# EAGLE design Button_Input_Card (EAGLE 7.6.0)

## Sheet 1 of 2
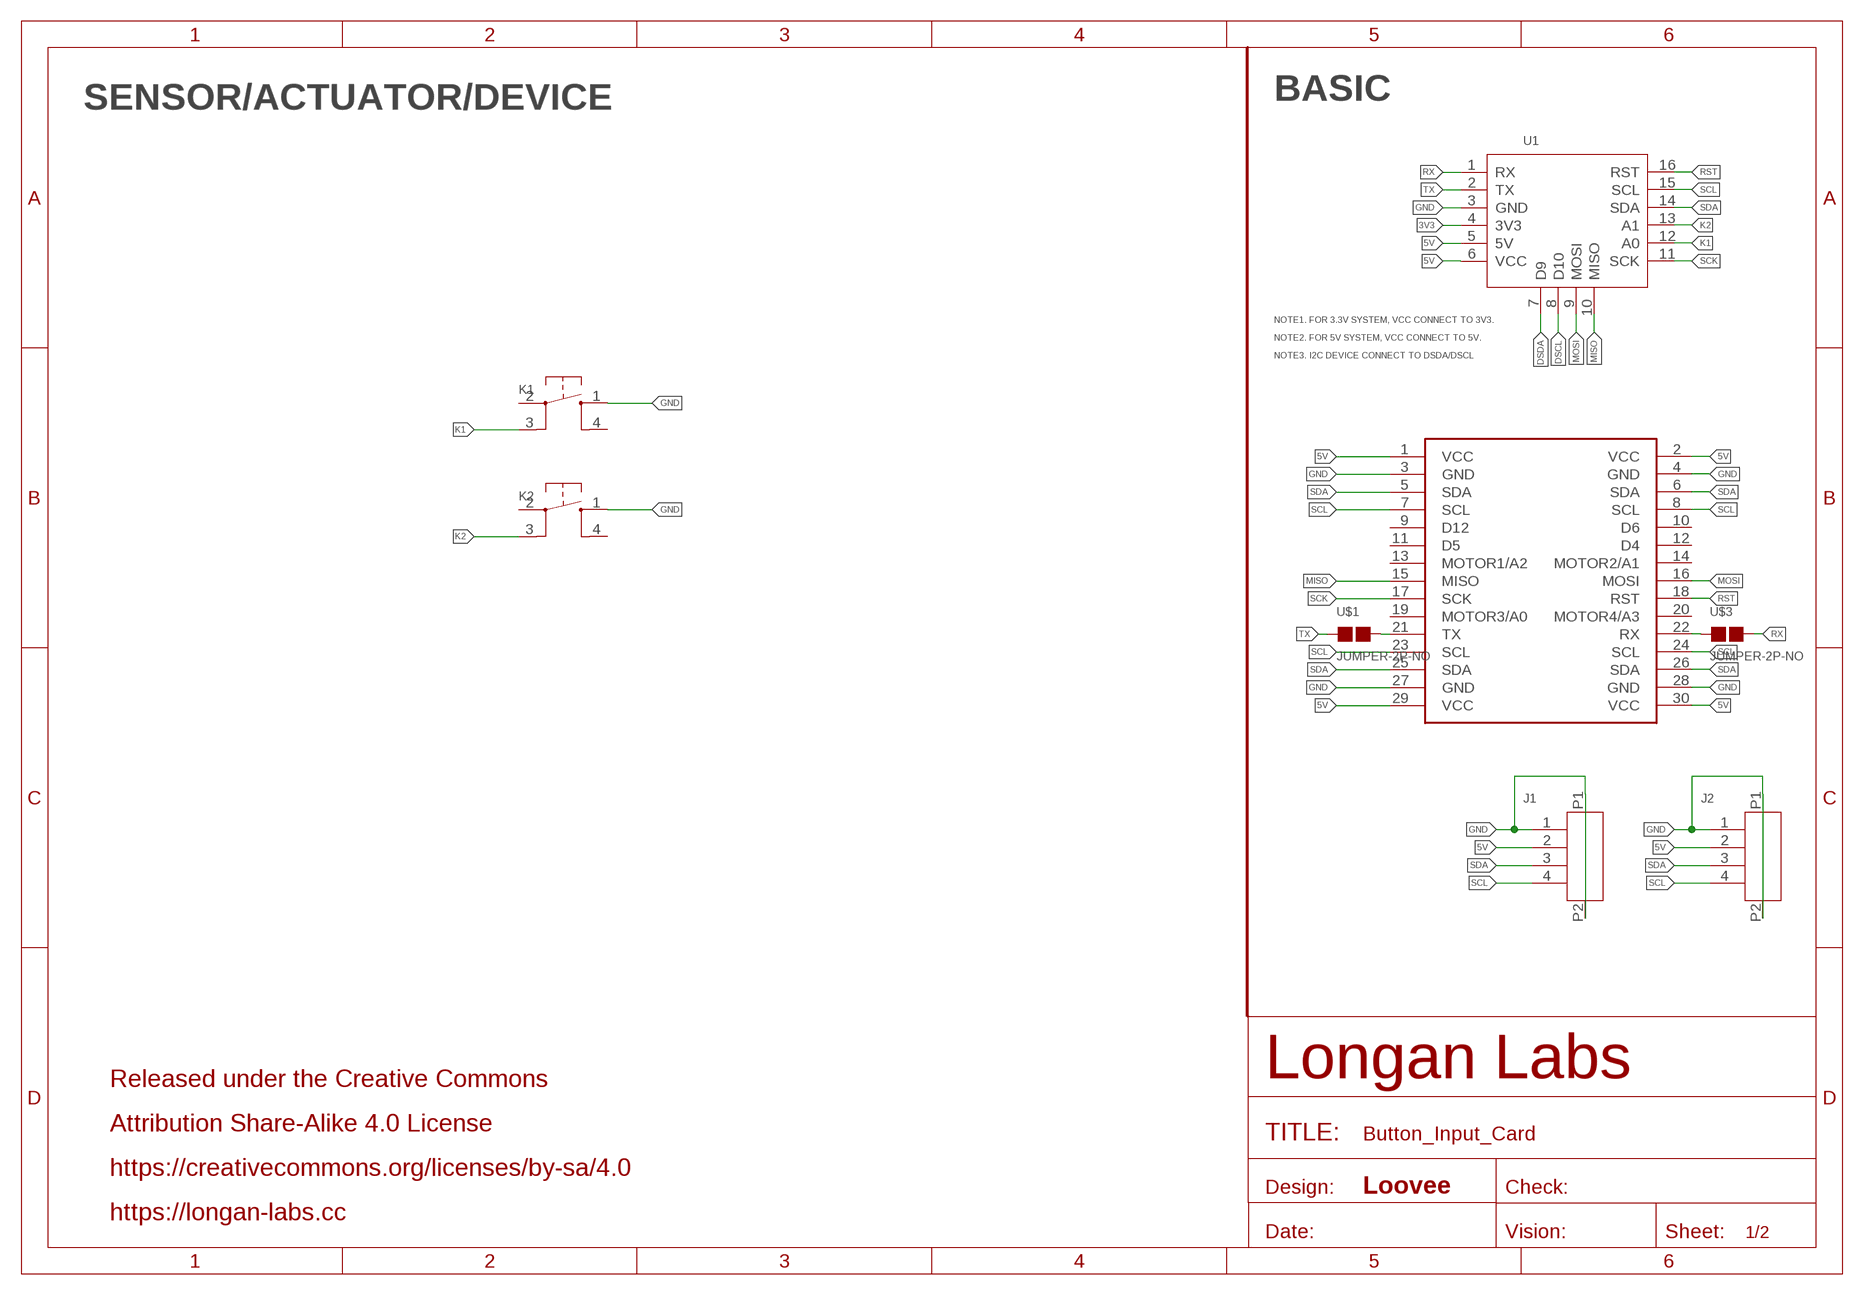
[diagram p0: schematic, sheet 1]

### Parts
J1  HEADER-4P-1.0  [4P-1.0-90D]
J2  HEADER-4P-1.0  [4P-1.0-90D]
K1  BUTTON-4P-SMT-TS-1103CW  [SW4-SMD-5.0-12X12X7.5MM]
K2  BUTTON-4P-SMT-TS-1103CW  [SW4-SMD-5.0-12X12X7.5MM]
MOUDLE1  MOUDLE-2X15P-2.54'BOARD'  [MOUDLE-2X15P-2.54]
U1  MOUDLE-CARDS  [16P-2.0-CARDS]
U$1  JUMPER-2P-NO  [2P-SMD-NO]
U$3  JUMPER-2P-NO  [2P-SMD-NO]

### Nets
3V3: U1.4(3V3)
5V: J1.2 J2.2 MOUDLE1.1(VCC) MOUDLE1.2(VCC) MOUDLE1.29(VCC) MOUDLE1.30(VCC) U1.5(5V) U1.6(VCC)
DSCL: U1.8(D10)
DSDA: U1.7(D9)
GND: J1.1 J1.P1 J1.P2 J2.1 J2.P1 J2.P2 K1.1 K2.1 MOUDLE1.3(GND) MOUDLE1.4(GND) MOUDLE1.27(GND) MOUDLE1.28(GND) U1.3(GND)
K1: K1.3 U1.12(A0)
K2: K2.3 U1.13(A1)
MISO: MOUDLE1.15(MISO) U1.10(MISO)
MOSI: MOUDLE1.16(MOSI) U1.9(MOSI)
N$1: MOUDLE1.21(TX) U$1.2
N$4: MOUDLE1.22(RX) U$3.1
RST: MOUDLE1.18(RST) U1.16(RST)
RX: U1.1(RX) U$3.2
SCK: MOUDLE1.17(SCK) U1.11(SCK)
SCL: J1.4 J2.4 MOUDLE1.7(SCL) MOUDLE1.8(SCL) MOUDLE1.23(SCL) MOUDLE1.24(SCL) U1.15(SCL)
SDA: J1.3 J2.3 MOUDLE1.5(SDA) MOUDLE1.6(SDA) MOUDLE1.25(SDA) MOUDLE1.26(SDA) U1.14(SDA)
TX: U1.2(TX) U$1.1
Unconnected: K1.2 K1.4 K2.2 K2.4 MOUDLE1.9(D12) MOUDLE1.10(D6) MOUDLE1.11(D5) MOUDLE1.12(D4) MOUDLE1.13(MOTOR1/A2) MOUDLE1.14(MOTOR2/A1) MOUDLE1.19(MOTOR3/A0) MOUDLE1.20(MOTOR4/A3)

### Notes on the sheet
- SENSOR/ACTUATOR/DEVICE | BASIC
- NOTE1. FOR 3.3V SYSTEM, VCC CONNECT TO 3V3.
- NOTE2. FOR 5V SYSTEM, VCC CONNECT TO 5V.
- NOTE3. I2C DEVICE CONNECT TO DSDA/DSCL
- Released under the Creative Commons
- Attribution Share-Alike 4.0 License
- https://creativecommons.org/licenses/by-sa/4.0
- Loovee
- https://longan-labs.cc

## Sheet 2 of 2

## Library data of the parts
J1 J2 = Longan-Connect:HEADER-4P-1.0
K1 K2 = Discrete-new:BUTTON-4P-SMT
MOUDLE1 = Longan-moudle:MOUDLE-2X15P-2.54
U1 = MOUDLE-CARDS:MOUDLE-CARDS
U$1 U$3 = Discrete-new:JUMPER-2P-NO

## Board
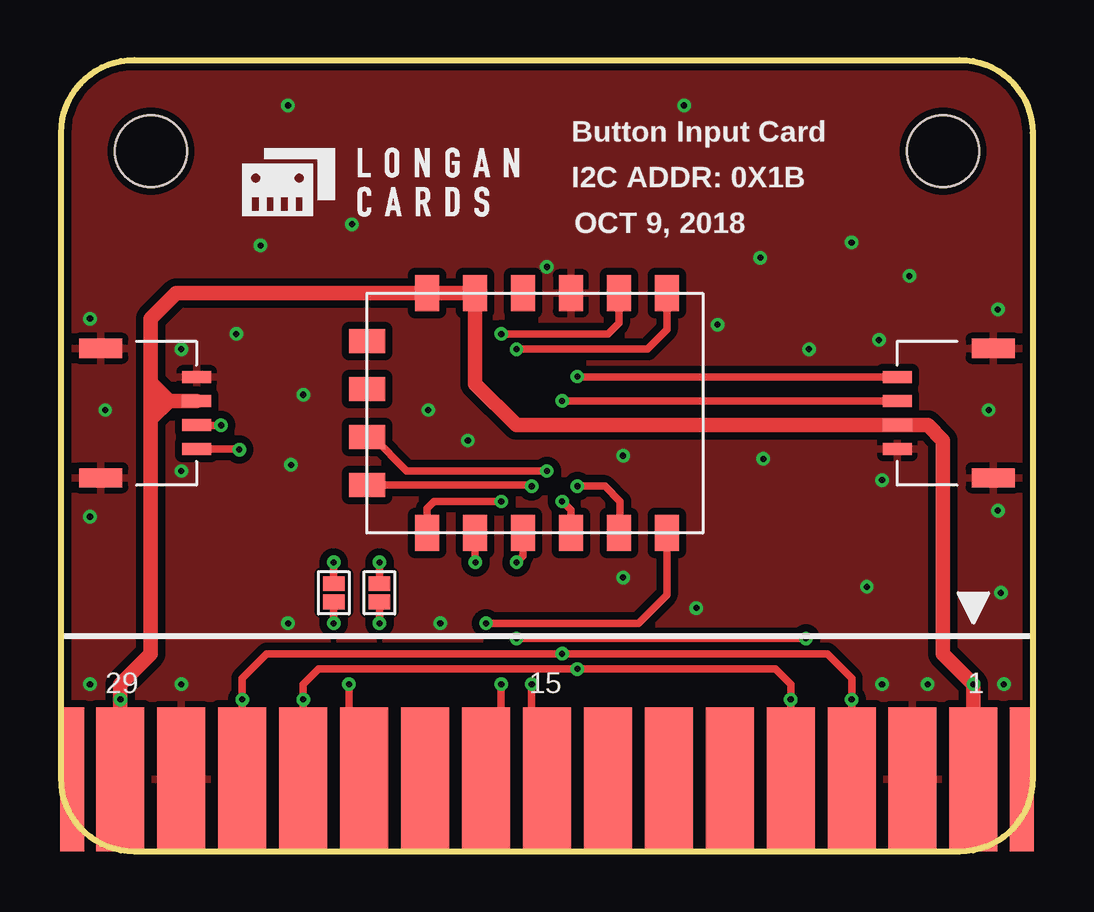
[diagram p1: board, top side]
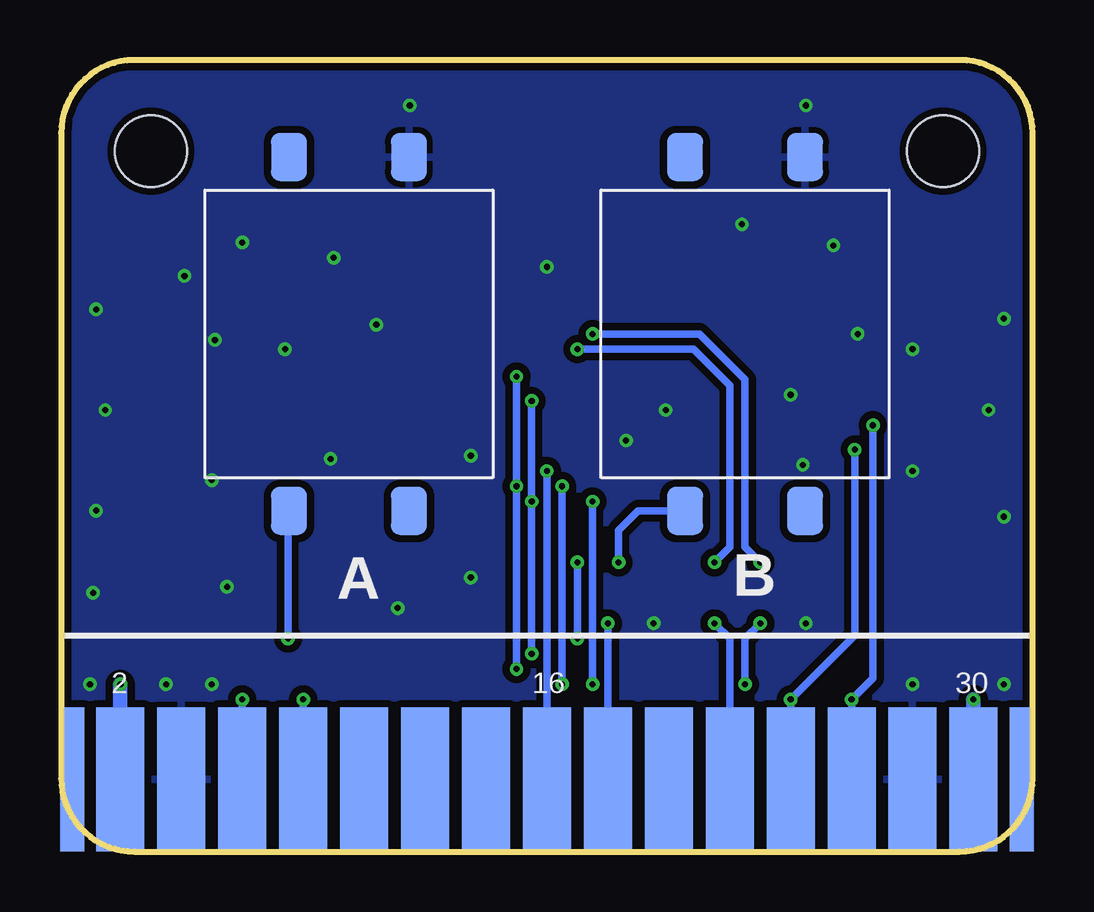
[diagram p2: board, bottom side, seen from below]

Size 40.5 x 33 mm. Coordinates in mm from the lower left corner, seen from the top.
Copper layers (1*16): Top 0.035mm / dielectric 1.5mm / Bottom 0.035mm
Design rules "SeeedStudio_2layer_DRU_no_angle_20140221 *": minimum track width 6mil, minimum drill 10mil, track to track 6mil, track to pad 6mil, pad to pad 6mil, via to via 6mil, smd to smd 0mil, copper to edge 10mil, drill to drill 10mil, minimum pad ring 10mil, minimum via ring 6mil, stop-mask expansion 2mil, vias tented up to drill 25mil, thermal gap 10mil

### Footprints (pad centres in the part's own frame; a part is rotated, then mirrored left to right if it is on the bottom)
4P-1.0-90D = smd 1.2 x 0.5: 1 0,1.5; 2 0,0.5; 3 0,-0.5; 4 0,-1.5 | smd 1.8 x 0.8: P1 -4,2.7; P2 -4,-2.7
SW4-SMD-5.0-12X12X7.5MM = smd 2 x 1.5: 1 -7.375,2.5; 2 -7.375,-2.5; 3 7.375,-2.5; 4 7.375,2.5
MOUDLE-2X15P-2.54 = smd 2 x 6: 1 17.78,-13.492; 3 15.24,-13.492; 5 12.7,-13.492; 7 10.16,-13.492; 9 7.62,-13.492; 11 5.08,-13.492; 13 2.54,-13.492; 15 0,-13.492; 17 -2.54,-13.492; 19 -5.08,-13.492; 21 -7.62,-13.492; 23 -10.16,-13.492; 25 -12.7,-13.492; 27 -15.24,-13.492; 29 -17.78,-13.492 | smd 2 x 6 bottom: 2 17.78,-13.492; 4 15.24,-13.492; 6 12.7,-13.492; 8 10.16,-13.492; 10 7.62,-13.492; 12 5.08,-13.492; 14 2.54,-13.492; 16 0,-13.492; 18 -2.54,-13.492; 20 -5.08,-13.492; 22 -7.62,-13.492; 24 -10.16,-13.492; 26 -12.7,-13.492; 28 -15.24,-13.492; 30 -17.78,-13.492 | smd 1 x 6: P1 -19.8,-13.492; P4 19.8,-13.492 | smd 1 x 6 bottom: P2 -19.8,-13.492; P3 19.8,-13.492 | hole 3: -16.51,12.7; 16.51,12.7
16P-2.0-CARDS = smd 1.5 x 1: 1 -5,5; 2 -5,3; 3 -5,1; 4 -5,-1; 5 -5,-3; 6 -5,-5; 11 5,-5; 12 5,-3; 13 5,-1; 14 5,1; 15 5,3; 16 5,5 | smd 1 x 1.5: 7 -3,-7.5; 8 -1,-7.5; 9 1,-7.5; 10 3,-7.5
2P-SMD-NO = smd 0.889 x 0.61: 1 0,0.381; 2 0,-0.381

### Placement (x,y rotation side)
J1  5.64,18.28 0 top
J2  34.86,18.28 180 top
K1  11.99,21.58 270 bottom
K2  28.51,21.58 270 bottom
MOUDLE1  20.25,16.5 0 top
U1  20.25,18.28 270 top
U$1  11.36,10.79 0 top
U$2  [LONGAN-CARDS-SMALL]  7.04,26.15 0 top
U$3  13.27,10.79 180 top

### Tracks (layer width: path | path; a pad name or v marks a point on that pad's centre or on a via)
5V  (via drill 0.25 pad 0.51)
  Top 0.61: 3.74,19.55 3.74,22.21 4.8,23.28 U1.6 U1.5 17.25,19.5 18.97,17.78 J2.2 36.12,17.78 36.76,17.14 36.76,8.24 v38.03,6.97 MOUDLE1.2 | 3.74,19.55 3.74,18.79 | 3.74,18.79 3.74,18.02 | 3.74,18.02 3.74,8.24 2.47,6.97 v2.47,6.34 MOUDLE1.30 | J1.2 4.51,18.78 | 4.51,18.78 3.75,18.78 3.74,18.79 | 4.51,18.78 3.74,19.55 | 4.65,18.78 4.49,18.78 3.74,18.02
  Bottom 0.61: v38.03,6.97 MOUDLE1.2 | v2.47,6.34 MOUDLE1.30
GND  (via drill 0.25 pad 0.51)
  other vias: 34.22,6.97 36.12,6.97 39.3,6.97 5.01,6.97 9.46,9.52 1.2,6.97 1.84,18.41 5.01,15.87 1.2,13.96 1.2,22.21 5.01,20.95 27.36,21.96 38.66,18.41 39.05,22.6 39.05,14.21 34.22,15.48 34.09,21.33 31.17,20.95 32.95,25.39 35.36,23.99 33.59,11.04 39.17,10.79 9.58,16.12 10.09,19.04 23.43,11.42 26.47,10.15 29.14,24.76 20.25,24.37 12.12,26.15 9.46,31.11 15.3,18.41 16.95,17.14 23.43,16.5 29.27,16.37 7.3,21.58 8.31,25.26 15.8,9.52 25.96,31.11
  pour Top (isolate 0.305): -0.07,33.01 40.57,33.01 40.57,-0.01 -0.07,-0.01
  pour Bottom (isolate 0.305): -0.07,33.01 40.57,33.01 40.57,-0.01 -0.07,-0.01
K1  (via drill 0.25 pad 0.51)
  Top 0.305: U1.12 17.25,12.07 v17.27,12.05
  Bottom 0.305: v17.27,12.05 17.27,13.39 16.45,14.21 K1.3
K2  (via drill 0.25 pad 0.51)
  Top 0.305: U1.13 19.25,12.32 v18.98,12.05 | v18.98,8.88 v31.05,8.88
  Bottom 0.305: v18.98,12.05 v18.98,8.88 | v31.05,8.88 31.05,14.16 K2.3
MISO  (via drill 0.25 pad 0.51)
  Top 0.305: U1.10 19.57,15.28 v19.61,15.23 | v19.61,6.97 19.61,3.64 MOUDLE1.15
  Bottom 0.305: v19.61,15.23 v19.61,6.97
MOSI  (via drill 0.25 pad 0.51)
  Top 0.305: U1.9 13,17.28 14.41,15.87 v20.25,15.87
  Bottom 0.305: v20.25,15.87 MOUDLE1.16
N$1  (via drill 0.25 pad 0.51)
  Top 0.305: MOUDLE1.21 12.63,3.8 11.99,4.44 v11.99,6.97 | v11.36,9.52 U$1.2
  Bottom 0.305: v11.99,6.97 11.99,8.88 v11.36,9.52
N$4  (via drill 0.25 pad 0.51)
  Top 0.305: v13.27,9.52 U$3.1
  Bottom 0.305: MOUDLE1.22 12.63,8.88 v13.27,9.52
RST  (via drill 0.25 pad 0.51)
  Top 0.305: v17.71,9.52 24.06,9.52 25.25,10.71 U1.16
  Bottom 0.305: v17.71,9.52 MOUDLE1.18
RX  (via drill 0.25 pad 0.51)
  Top 0.305: 25.2,23.23 U1.1 25.25,21.75 24.44,20.95 v18.98,20.95 | v13.27,12.05 U$3.2
  Bottom 0.305: v18.98,20.95 14.15,20.95 12.63,19.42 12.63,12.69 v13.27,12.05
SCK  (via drill 0.25 pad 0.51)
  Top 0.305: v18.34,14.6 15.55,14.6 15.25,14.29 U1.11 | v18.34,6.97 18.34,3.64 MOUDLE1.17
  Bottom 0.305: v18.34,6.97 v18.34,14.6
SCL  (via drill 0.25 pad 0.51)
  Top 0.305: J1.4 7.4,16.78 v7.42,16.75 | U1.15 23.3,13.23 23.3,14.6 22.66,15.23 v21.52,15.23 | J2.4 21.54,19.78 v21.52,19.8 | MOUDLE1.8 v30.41,6.34 30.41,6.97 29.77,7.61 v21.52,7.61 10.72,7.61 10.09,6.97 10.09,6.85 v10.09,6.34 MOUDLE1.23
  Bottom 0.305: v7.42,16.75 7.42,9.01 v10.09,6.34 MOUDLE1.23 | v21.52,7.61 v21.52,15.23 v21.52,19.8 | v30.41,6.34 MOUDLE1.8
SDA  (via drill 0.25 pad 0.51)
  Top 0.305: v6.66,17.77 5.65,17.77 J1.3 | J2.3 20.89,18.78 v20.89,18.79 | U1.14 21.25,14.23 v20.89,14.6 | MOUDLE1.6 v32.95,6.34 32.95,7.23 31.93,8.24 v20.89,8.24 8.57,8.24 7.55,7.23 v7.55,6.34 MOUDLE1.25
  Bottom 0.305: v6.66,17.77 6.66,7.23 v7.55,6.34 MOUDLE1.25 | v20.89,8.24 v20.89,14.6 v20.89,18.79 | v32.95,6.34 MOUDLE1.6
TX  (via drill 0.25 pad 0.51)
  Top 0.305: 23.3,23.23 U1.2 23.25,22.04 22.79,21.58 v18.34,21.58 | v11.36,12.05 U$1.1
  Bottom 0.305: v18.34,21.58 13.9,21.58 11.99,19.68 11.99,12.69 v11.36,12.05

### Text on the board
tPlace: Button Input Card | I2C ADDR: 0X1B | OCT 9, 2018
bPlace: B | A